# EAGLE design Dartautomat (EAGLE 9.6.2)
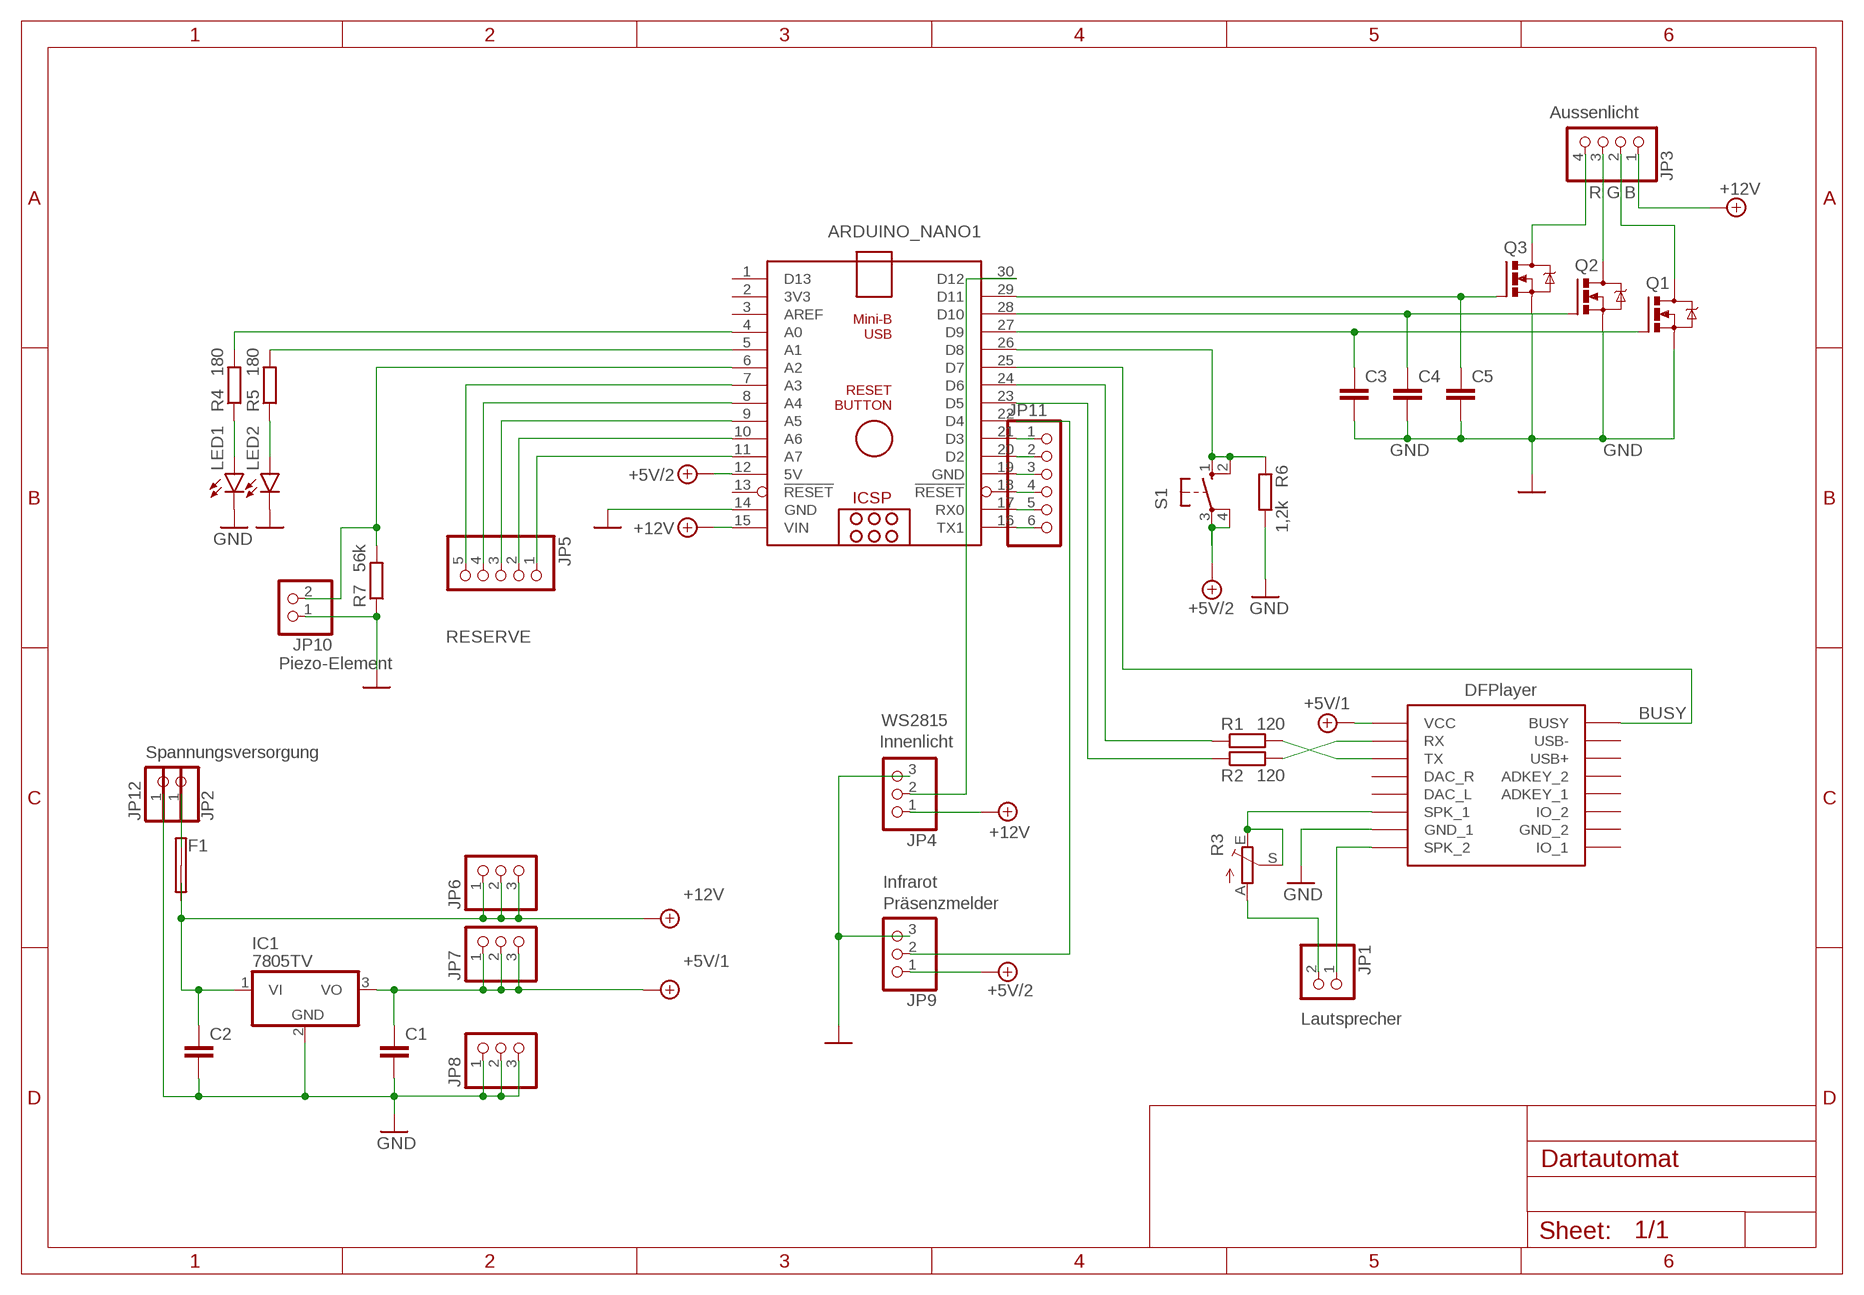
[diagram p0: schematic, sheet 1]

## Parts
ARDUINO_NANO1  ARDUINO_NANO  [ARDUINO_NANO]
C1  C-EU050-045X075  [C050-045X075]
C2  C-EU050-045X075  [C050-045X075]
C3  C-EU050-045X075  [C050-045X075]
C4  C-EU050-045X075  [C050-045X075]
C5  C-EU050-045X075  [C050-045X075]
F1  SHK20L  [SHK20L]
IC1  7805TV  [TO220V]
JP1  PINHD-1X2  [1X02]
JP2  PINHD-1X1  [1X01]
JP3  PINHD-1X4  [1X04]
JP4  PINHD-1X3  [1X03]
JP5  PINHD-1X5  [1X05]
JP6  PINHD-1X3  [1X03]
JP7  PINHD-1X3  [1X03]
JP8  PINHD-1X3  [1X03]
JP9  PINHD-1X3  [1X03]
JP10  PINHD-1X2  [1X02]
JP11  PINHD-1X6  [1X06]
JP12  PINHD-1X1  [1X01]
LED1  LED3MM  [LED3MM]
LED2  LED3MM  [LED3MM]
Q1  IRLZ44ZNEU  [TO220BV]
Q2  IRLZ44ZNEU  [TO220BV]
Q3  IRLZ44ZNEU  [TO220BV]
R1  120  R-EU_0207/10  [0207/10]
R2  120  R-EU_0207/10  [0207/10]
R3  TRIM_EU-CA6H  [CA6H]
R4  180  R-EU_0207/12  [0207/12]
R5  180  R-EU_0207/12  [0207/12]
R6  1,2k  R-EU_0207/12  [0207/12]
R7  56k  R-EU_0207/12  [0207/12]
S1  10-XX  [B3F-10XX]
U$1  DFPLAYER  [DFPLAYER]

## Nets
+5V/1: C1.1 IC1.3(VO) JP7.1 JP7.2 JP7.3 U$1.VCC
+5V/2: ARDUINO_NANO1.12(5V) JP9.1 S1.3(P) S1.4(P1)
+12V: ARDUINO_NANO1.15(VIN) C2.1 F1.1A F1.1B IC1.1(VI) JP3.1 JP4.1 JP6.1 JP6.2 JP6.3
BUSY: ARDUINO_NANO1.25(D7) U$1.BUSY
GND: ARDUINO_NANO1.14(GND) C1.2 C2.2 C3.2 C4.2 C5.2 IC1.2(GND) JP4.3 JP8.1 JP8.2 JP8.3 JP9.3 JP10.1 JP12.1 LED1.K(C) LED2.K(C) Q1.S Q2.S Q3.S R6.2 R7.1 U$1.GND_1
N$1: ARDUINO_NANO1.30(D12) JP4.2
N$2: R2.2 U$1.RX
N$3: ARDUINO_NANO1.29(D11) C5.1 Q3.G
N$4: R1.2 U$1.TX
N$5: JP1.2 R3.A
N$6: JP1.1 U$1.SPK2(SPK_2)
N$7: R3.E R3.S U$1.SPK1(SPK_1)
N$8: JP3.3 Q2.D
N$9: ARDUINO_NANO1.23(D5) R2.1
N$10: ARDUINO_NANO1.21(D3) JP11.1
N$11: JP3.2 Q1.D
N$12: JP3.4 Q3.D
N$13: ARDUINO_NANO1.24(D6) R1.1
N$14: ARDUINO_NANO1.20(D2) JP11.2
N$15: LED1.A R4.1
N$16: LED2.A R5.1
N$17: ARDUINO_NANO1.5(A1) R5.2
N$18: ARDUINO_NANO1.4(A0) R4.2
N$19: ARDUINO_NANO1.11(A7) JP5.1
N$20: ARDUINO_NANO1.10(A6) JP5.2
N$21: ARDUINO_NANO1.9(A5) JP5.3
N$22: ARDUINO_NANO1.8(A4) JP5.4
N$23: ARDUINO_NANO1.7(A3) JP5.5
N$24: ARDUINO_NANO1.6(A2) JP10.2 R7.2
N$25: ARDUINO_NANO1.22(D4) JP9.2
N$26: ARDUINO_NANO1.26(D8) R6.1 S1.1(S) S1.2(S1)
N$27: F1.2A F1.2B JP2.1
N$28: ARDUINO_NANO1.19(GND) JP11.3
N$29: ARDUINO_NANO1.18(!RESET) JP11.4
N$30: ARDUINO_NANO1.17(RX0) JP11.5
N$31: ARDUINO_NANO1.27(D9) C3.1 Q1.G
N$32: ARDUINO_NANO1.16(TX1) JP11.6
N$33: ARDUINO_NANO1.28(D10) C4.1 Q2.G
Unconnected: ARDUINO_NANO1.1(D13) ARDUINO_NANO1.2(3V3) ARDUINO_NANO1.3(AREF) ARDUINO_NANO1.13(!RESET) U$1.ADKEY1(ADKEY_1) U$1.ADKEY2(ADKEY_2) U$1.DAC_L U$1.DAC_R U$1.GND_2 U$1.IO1(IO_1) U$1.IO2(IO_2) U$1.USB+ U$1.USB-

## Notes on the sheet
- Aussenlicht
- R | G | B
- RESERVE
- Piezo-Element
- DFPlayer
- WS2815
- Innenlicht
- Spannungsversorgung
- Infrarot
- Präsenzmelder
- Lautsprecher

## Library data of the parts
ARDUINO_NANO1 = ArduinoNanoV30:ARDUINO_NANO: Arduino Nano V3.0 Overview: The Arduino Nano is a small, complete, and breadboard-friendly board based on the ATmega328 (Arduino Nano 3.x) or ATmega168 (Arduino Nano 2.x). It has more or less the same functionality of the Arduino Duemilanove, but in a different package. It lacks only a DC power jack, and works with a Mini-B USB cable instead of a standard one. The Nano was designed and is being produced by Gravitech. Specifications: Microcontroller Atmel ATmega168 or ATmega328 Operating Voltage (logic level) 5 V Input Voltage (recommended) 7-12 V Input Voltage (limits) 6-20 V Digital I/O Pins 14 (of which 6 provide PWM output) Analog Input Pins 8 DC Current per I/O Pin 40 mA Flash Memory 16 KB (ATmega168) or 32 KB (ATmega328) of which 2 KB used by bootloader SRAM 1 KB (ATmega168) or 2 KB (ATmega328) EEPROM 512 bytes (ATmega168) or 1 KB (ATmega328) Clock Speed 16 MHz Dimensions 0.73" x 1.70" Length 45 mm Width 18 mm Weigth 5 g Power: The Arduino Nano can be powered via the Mini-B USB connection, 6-20V unregulated external power supply (pin 30), or 5V regulated external power supply (pin 27). The power source is automatically selected to the highest voltage source. Memory: The ATmega168 has 16 KB of flash memory for storing code (of which 2 KB is used for the bootloader); the ATmega328 has 32 KB, (also with 2 KB used for the bootloader). The ATmega168 has 1 KB of SRAM and 512 bytes of EEPROM (which can be read and written with the EEPROM library); the ATmega328 has 2 KB of SRAM and 1 KB of EEPROM. Input and Output: Each of the 14 digital pins on the Nano can be used as an input or output, using pinMode(), digitalWrite(), and digitalRead() functions. They operate at 5 volts. Each pin can provide or receive a maximum of 40 mA and has an internal pull-up resistor (disconnected by default) of 20-50 kOhms. In addition, some pins have specialized functions. Visit Arduino - ArduinoBoardNano <https://www.arduino.cc/en/Main/ArduinoBoardNano>
C1-C5 = rcl:C-EU: CAPACITOR, European symbol; SPICEPREFIX: C
F1 = fuse:SHK20L: FUSE HOLDER 5 x 20 mm, SH contact, SHH1 Schukat, E1073 Buerklin; OC_FARNELL: unknown; OC_NEWARK: unknown
IC1 = linear:78*: Positive VOLTAGE REGULATOR Source: http://cache.national.com/ds/LM/LM78L05.pdf http://www.fairchildsemi.com/ds/LM/LM7805.pdf
JP1 JP10 = pinhead:PINHD-1X2: PIN HEADER
JP2 JP12 = pinhead:PINHD-1X1: PIN HEADER
JP3 = pinhead:PINHD-1X4: PIN HEADER
JP4 JP6-JP9 = pinhead:PINHD-1X3: PIN HEADER
JP5 = pinhead:PINHD-1X5: PIN HEADER
JP11 = pinhead:PINHD-1X6: PIN HEADER
LED1 LED2 = led:LED: LED OSRAM: - CHIPLED LG R971, LG N971, LY N971, LG Q971, LY Q971, LO R971, LY R971 LH N974, LH R974 LS Q976, LO Q976, LY Q976 LO Q996 - Hyper CHIPLED LW Q18S LB Q993, LB Q99A, LB R99A - SideLED LS A670, LO A670, LY A670, LG A670, LP A670 LB A673, LV A673, LT A673, LW A673 LH A674 LY A675 LS A676, LA A676, LO A676, LY A676, LW A676 LS A679, LY A679, LG A679 - Hyper Micro SIDELED® LS Y876, LA Y876, LO Y876, LY Y876 LT Y87S - SmartLED LW L88C, LW L88S LB L89C, LB L89S, LG L890 LS L89K, LO L89K, LY L89K LS L896, LA L896, LO L896, LY L896 - TOPLED LS T670, LO T670, LY T670, LG T670, LP T670 LSG T670, LSP T670, LSY T670, LOP T670, LYG T670 LG T671, LOG T671, LSG T671 LB T673, LV T673, LT T673, LW T673 LH T674 LS T676, LA T676, LO T676, LY T676, LB T676, LH T676, LSB T676, LW T676 LB T67C, LV T67C, LT T67C, LS T67K, LO T67K, LY T67K, LW E67C LS E67B, LA E67B, LO E67B, LY E67B, LB E67C, LV E67C, LT E67C LW T67C LS T679, LY T679, LG T679 LS T770, LO T770, LY T770, LG T770, LP T770 LB T773, LV T773, LT T773, LW T773 LH T774 LS E675, LA E675, LY E675, LS T675 LS T776, LA T776, LO T776, LY T776, LB T776 LHGB T686 LT T68C, LB T68C - Hyper Mini TOPLED® LB M676 - Mini TOPLED Santana® LG M470 LS M47K, LO M47K, LY M47K Source: http://www.osram.convergy.de LUXEON: - LUMILED® LXK2-PW12-R00, LXK2-PW12-S00, LXK2-PW14-U00, LXK2-PW14-V00 LXK2-PM12-R00, LXK2-PM12-S00, LXK2-PM14-U00 LXK2-PE12-Q00, LXK2-PE12-R00, LXK2-PE12-S00, LXK2-PE14-T00, LXK2-PE14-U00 LXK2-PB12-K00, LXK2-PB12-L00, LXK2-PB12-M00, LXK2-PB14-N00, LXK2-PB14-P00, LXK2-PB14-Q00 LXK2-PR12-L00, LXK2-PR12-M00, LXK2-PR14-Q00, LXK2-PR14-R00 LXK2-PD12-Q00, LXK2-PD12-R00, LXK2-PD12-S00 LXK2-PH12-R00, LXK2-PH12-S00 LXK2-PL12-P00, LXK2-PL12-Q00, LXK2-PL12-R00 Source: www.luxeon.com KINGBRIGHT: KA-3528ASYC Source: www.kingbright.com
Q1-Q3 = transistor-power-sven:IRLZ44Z: N-Channel HEXFET® Power MOSFET Logic Level AUTOMOTIVE MOSFET Source: http://www.irf.com/product-info/datasheets/data/irlz44zpbf.pdf
R1 R2 R4-R7 = rcl:R-EU_: RESISTOR, European symbol; SPICEPREFIX: R
R3 = pot:TRIM_EU-: POTENTIOMETER
S1 = switch-omron:10-XX: OMRON SWITCH; MPN: B3F-1000; OC_FARNELL: 176432; OC_NEWARK: 36M3542
U$1 = DFPlayer_v1:DFPLAYER

## Board
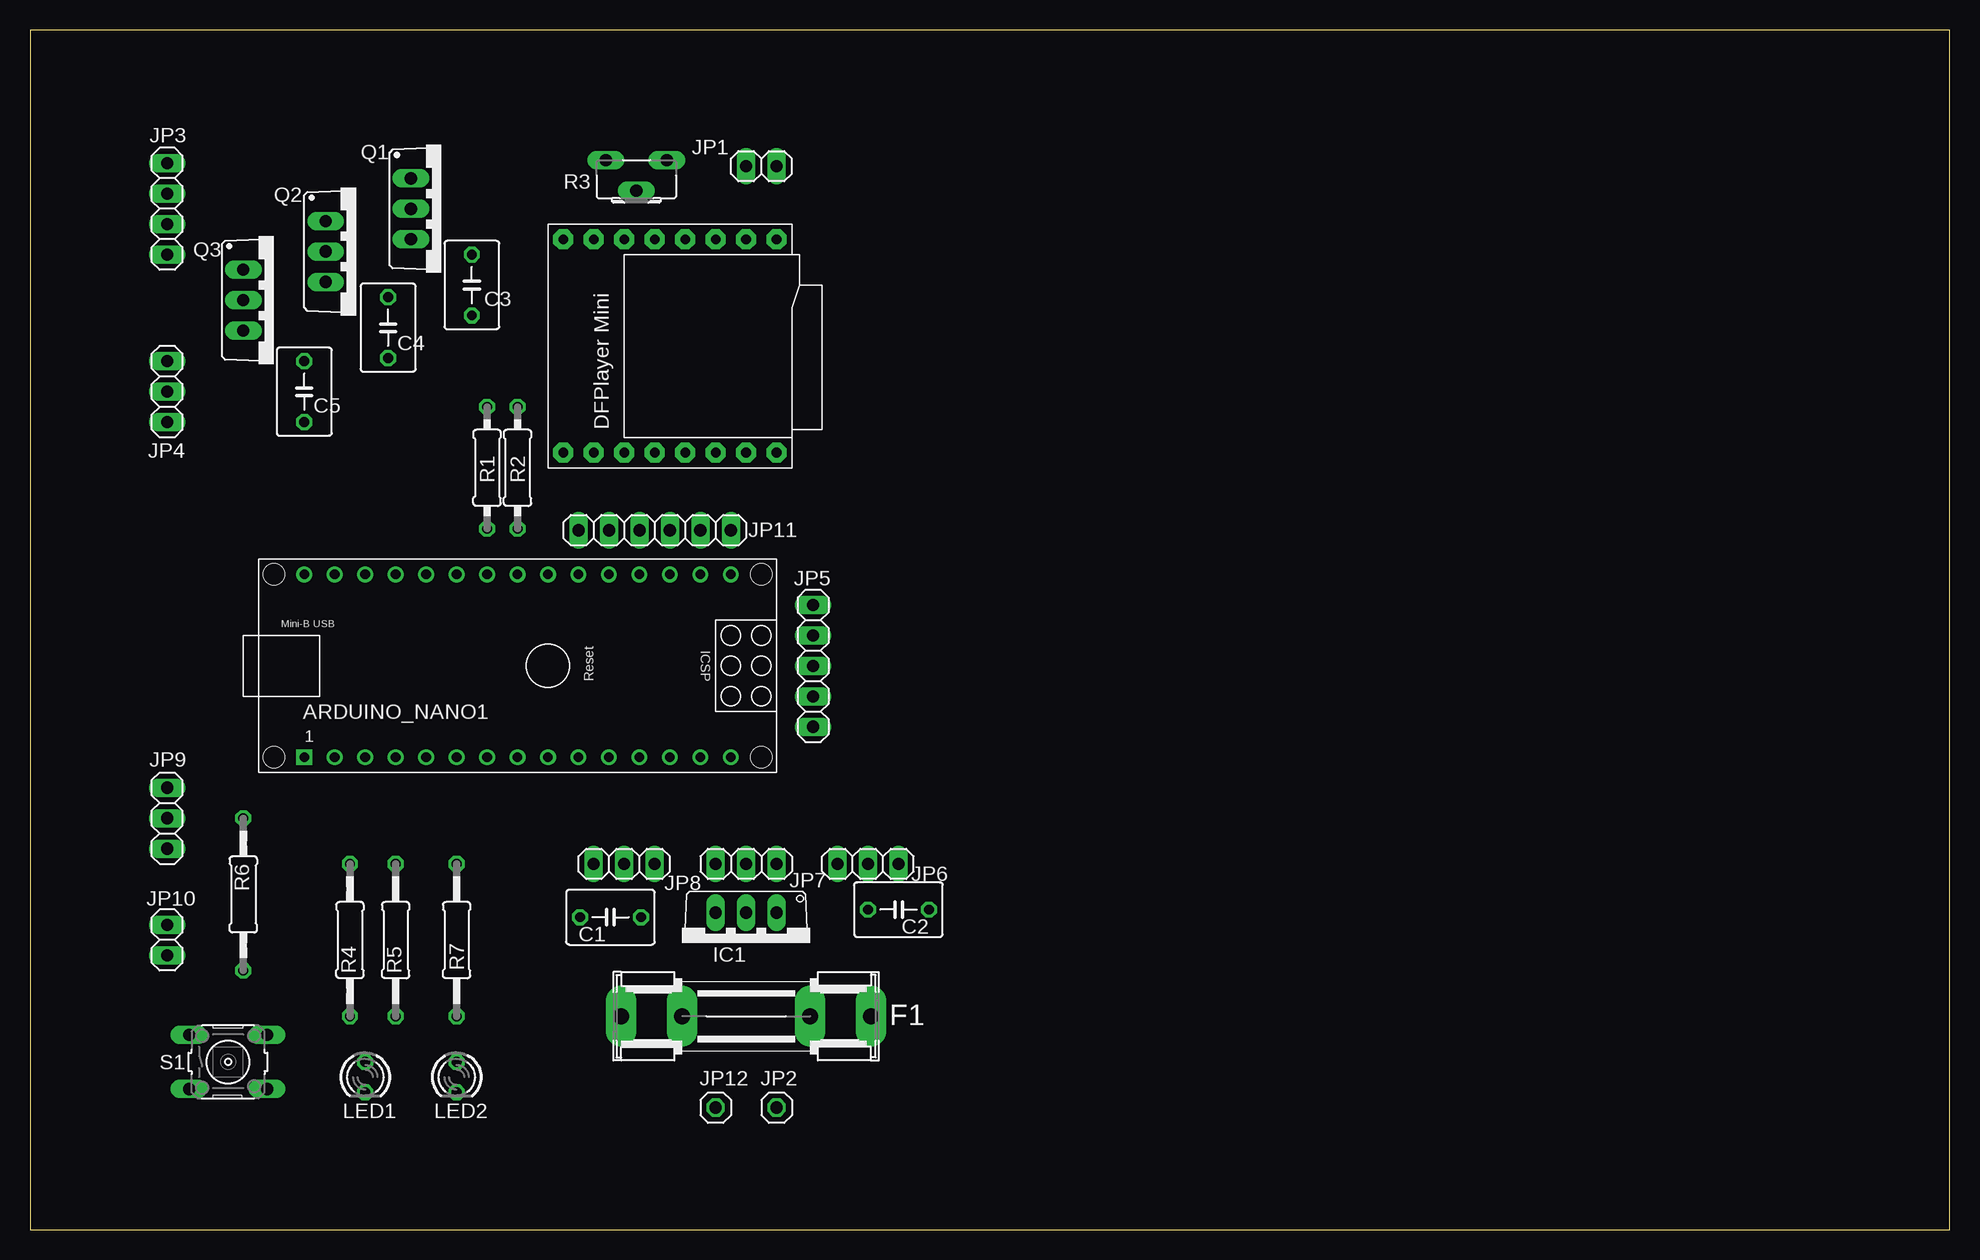
[diagram p1: board, top side]
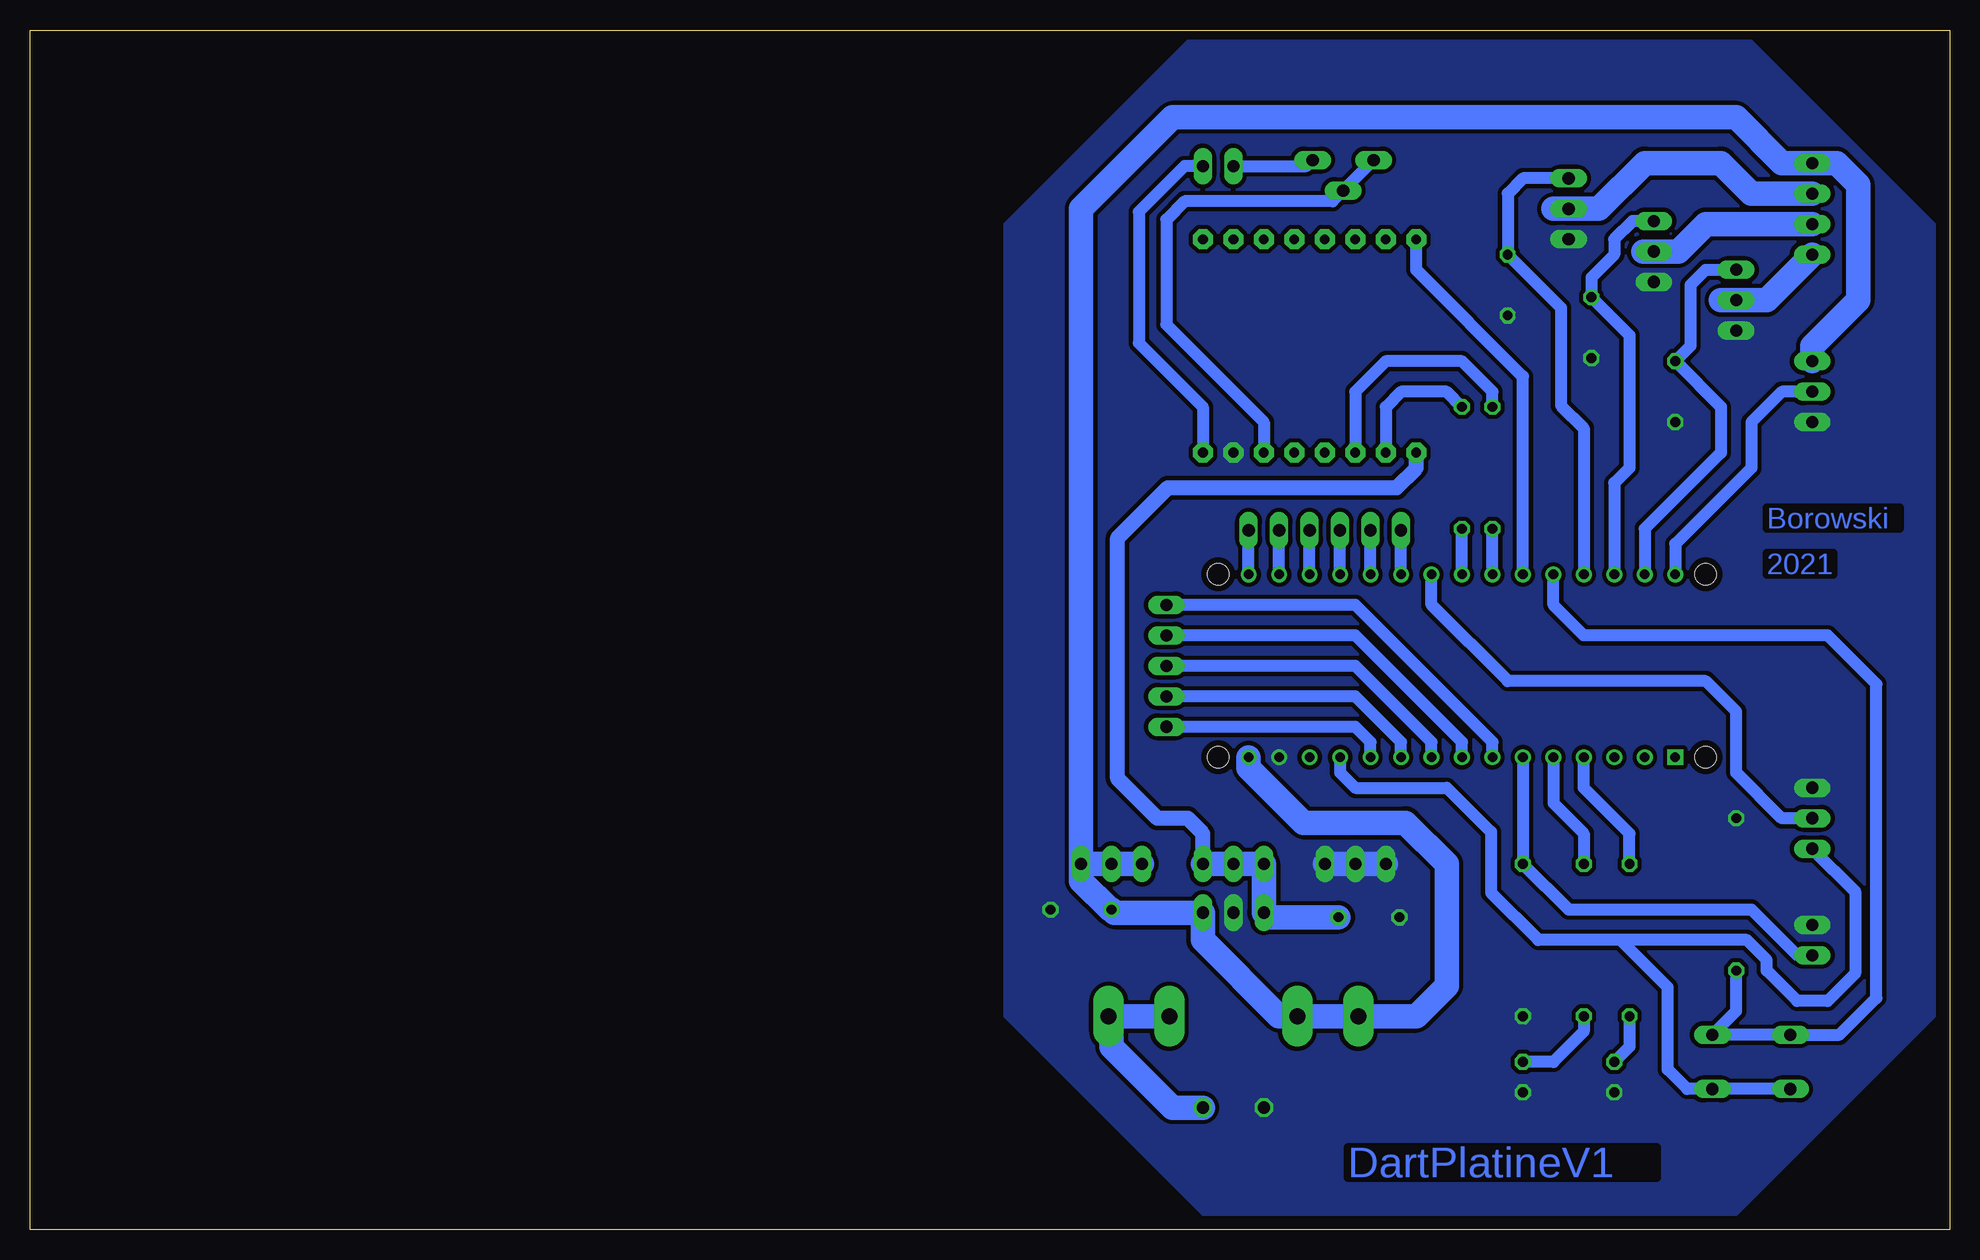
[diagram p2: board, bottom side, seen from below]

Size 160 x 100 mm. Coordinates in mm from the lower left corner, seen from the top.
Outline: 0,0 160,0 160,100 0,100 0,0
Copper layers (1*16): Top 0.035mm / dielectric 1.5mm / Bottom 0.035mm
Design rules "default *": minimum track width 6mil, minimum drill 0.35mm, track to track 14mil, track to pad 14mil, pad to pad 14mil, via to via 14mil, smd to smd 14mil, copper to edge 20mil, drill to drill 6mil, minimum pad ring 10mil, minimum via ring 8mil, stop-mask expansion 4mil, vias tented up to drill 0mil, thermal gap 0mil

### Footprints (pad centres in the part's own frame; a part is rotated, then mirrored left to right if it is on the bottom)
ARDUINO_NANO = drill 0.8 square: 1 -20.32,-7.62 | drill 0.8: 2 -17.78,-7.62; 3 -15.24,-7.62; 4 -12.7,-7.62; 5 -10.16,-7.62; 6 -7.62,-7.62; 7 -5.08,-7.62; 8 -2.54,-7.62; 9 0,-7.62; 10 2.54,-7.62; 11 5.08,-7.62; 12 7.62,-7.62; 13 10.16,-7.62; 14 12.7,-7.62; 15 15.24,-7.62; 16 15.24,7.62; 17 12.7,7.62; 18 10.16,7.62; 19 7.62,7.62; 20 5.08,7.62; 21 2.54,7.62; 22 0,7.62; 23 -2.54,7.62; 24 -5.08,7.62; 25 -7.62,7.62; 26 -10.16,7.62; 27 -12.7,7.62; 28 -15.24,7.62; 29 -17.78,7.62; 30 -20.32,7.62 | hole 1.778: -22.86,-7.62; -22.86,7.62; 17.78,7.62; 17.78,-7.62
C050-045X075 = drill 0.813 octagon: 1 -2.54,0; 2 2.54,0
SHK20L = drill 1.321 pad 2.54 long: 1A -10.414,0; 1B -5.334,0; 2A 10.414,0; 2B 5.334,0
TO220V = drill 1.016 long: 1 -2.54,-2.54; 2 0,-2.54; 3 2.54,-2.54
1X02 = drill 1.016 long: 1 -1.27,0; 2 1.27,0
1X01 = drill 1.016 octagon: 1 0,0
1X04 = drill 1.016 long: 1 -3.81,0; 2 -1.27,0; 3 1.27,0; 4 3.81,0
1X03 = drill 1.016 long: 1 -2.54,0; 2 0,0; 3 2.54,0
1X05 = drill 1.016 long: 1 -5.08,0; 2 -2.54,0; 3 0,0; 4 2.54,0; 5 5.08,0
1X06 = drill 1.016 long: 1 -6.35,0; 2 -3.81,0; 3 -1.27,0; 4 1.27,0; 5 3.81,0; 6 6.35,0
LED3MM = drill 0.813 octagon: A -1.27,0; K 1.27,0
TO220BV = drill 1.016 long: D 0,-2.54; G -2.54,-2.54; S 2.54,-2.54
0207/10 = drill 0.813 octagon: 1 -5.08,0; 2 5.08,0
CA6H = drill 1.016 long: A -2.54,0; E 2.54,0; S 0,2.54
0207/12 = drill 0.813 octagon: 1 -6.35,0; 2 6.35,0
B3F-10XX = drill 1.016 long: 1 -3.251,2.261; 2 3.251,2.261; 3 -3.251,-2.261; 4 3.251,-2.261
DFPLAYER = drill 0.8 pad 1.676 octagon: ADKEY1 8.89,-1.27; ADKEY2 8.89,1.27; BUSY 8.89,8.89; DAC_L -8.89,-1.27; DAC_R -8.89,1.27; GND_1 -8.89,-6.35; GND_2 8.89,-6.35; IO1 8.89,-8.89; IO2 8.89,-3.81; RX -8.89,6.35; SPK1 -8.89,-3.81; SPK2 -8.89,-8.89; TX -8.89,3.81; USB+ 8.89,3.81; USB- 8.89,6.35; VCC -8.89,8.89

### Placement (x,y rotation side)
ARDUINO_NANO1  43.18,46.99 0 top
C1  48.39,26.04 180 top
C2  72.39,26.67 0 top
C3  36.83,78.74 270 top
C4  29.84,75.18 270 top
C5  22.86,69.85 270 top
F1  59.69,17.78 0 top
IC1  59.69,23.88 180 top
JP1  60.96,88.65 180 top
JP2  62.23,10.16 0 top
JP3  11.43,85.09 270 top
JP4  11.43,69.85 270 top
JP5  65.28,46.99 90 top
JP6  69.85,30.48 180 top
JP7  59.69,30.48 0 top
JP8  49.53,30.48 180 top
JP9  11.43,34.29 90 top
JP10  11.43,24.13 270 top
JP11  52.07,58.29 0 top
JP12  57.15,10.16 0 top
LED1  27.94,12.7 270 top
LED2  35.56,12.7 270 top
Q1  34.29,85.09 270 top
Q2  27.18,81.53 270 top
Q3  20.32,77.47 270 top
R1  38.1,63.5 90 top
R2  40.64,63.5 90 top
R3  50.55,89.15 180 top
R4  26.67,24.13 90 top
R5  30.48,24.13 90 top
R6  17.78,27.94 90 top
R7  35.56,24.13 90 top
S1  16.51,13.97 0 top
U$1  53.34,73.66 90 top

### Tracks (layer width: path | path; a pad name or v marks a point on that pad's centre or on a via)
+5V/1
  Bottom 1.27: JP7.3 62.23,33.02 63.5,34.29 66.04,34.29 69.34,37.59 69.34,57.66 65.15,61.85 46.1,61.85 44.45,63.5 U$1.VCC
  Bottom 2.032: C1.1 56.77,26.04 IC1.3 JP7.1 JP7.2 JP7.3
+5V/2
  Bottom 1.016: ARDUINO_NANO1.12 50.8,38.1 49.53,36.83 41.91,36.83 38.23,33.15 38.23,28.07 34.29,24.13 27.43,24.13 | JP9.1 7.87,28.19 7.87,21.34 10.16,19.05 12.7,19.05 15.24,21.59 15.24,22.48 16.89,24.13 27.43,24.13 | 27.43,24.13 23.5,20.19 23.5,13.34 21.87,11.71 S1.4 S1.3
+12V
  Bottom 2.032: JP4.1 11.43,73.66 7.62,77.47 7.62,87.12 9.4,88.9 JP3.1 13.97,88.9 17.78,92.71 64.77,92.71 72.39,85.09 JP6.1 | ARDUINO_NANO1.15 58.42,38.48 53.85,33.91 45.34,33.91 41.91,30.48 41.91,20.32 44.45,17.78 F1.1A F1.1B 55.88,17.78 62.23,24.13 IC1.1 69.6,26.42 C2.1 69.98,26.67 72.39,29.08 JP6.1 | JP6.2 JP6.3 JP6.1
BUSY
  Bottom 1.016: U$1.BUSY 44.45,80.01 35.56,71.12 ARDUINO_NANO1.25
GND
  Bottom 2.032: JP8.1 JP8.3
  pour Bottom: 1.27,83.82 16.51,99.06 63.5,99.06 78.74,83.82 78.74,17.78 62.23,1.27 17.78,1.27 1.27,17.78
N$1
  Bottom 1.016: 12.7,69.85 JP4.2 13.97,69.85 16.51,67.31 16.51,63.5 22.86,57.15 ARDUINO_NANO1.30
N$2
  Bottom 1.016: R2.2 41.91,69.85 45.72,69.85 46.99,68.58 U$1.RX
N$3
  Bottom 1.016: Q3.G 20.32,80.01 21.59,78.74 21.59,73.66 C5.1 19.05,68.58 19.05,64.77 25.4,58.42 ARDUINO_NANO1.29
N$4
  Bottom 1.016: R1.2 38.1,69.85 40.64,72.39 46.99,72.39 49.53,69.85 U$1.TX
N$5
  Bottom 1.016: JP1.2 53.59,88.65 R3.A
N$6
  Bottom 1.016: JP1.1 63.75,88.65 67.56,84.84 67.56,73.91 62.23,68.58 U$1.SPK2
N$7
  Bottom 1.016: R3.E R3.S 51.44,85.72 63.75,85.72 65.28,84.2 65.28,75.44 57.15,67.31 U$1.SPK1
N$8
  Bottom 2.032: JP3.3 20.32,83.82 22.61,81.53 Q2.D 25.53,81.53
N$9
  Bottom 1.016: ARDUINO_NANO1.23 R2.1
N$10
  Bottom 1.016: ARDUINO_NANO1.21 JP11.1
N$11
  Bottom 2.032: JP3.2 16.51,86.36 19.05,88.9 25.4,88.9 29.21,85.09 Q1.D 33.02,85.09
N$12
  Bottom 0.305: Q3.D 19.05,77.47
  Bottom 2.032: JP3.4 15.24,77.47 19.05,77.47
N$13
  Bottom 1.016: ARDUINO_NANO1.24 R1.1
N$14
  Bottom 1.016: ARDUINO_NANO1.20 JP11.2
N$15
  Bottom 1.016: LED1.A 26.67,15.24 R4.1
N$16
  Bottom 1.016: R5.1 30.48,16.51 33.02,13.97 LED2.A
N$17
  Bottom 1.016: R5.2 30.48,33.02 33.02,35.56 ARDUINO_NANO1.5
N$18
  Bottom 1.016: R4.2 26.67,33.02 30.48,36.83 ARDUINO_NANO1.4
N$19
  Bottom 1.016: ARDUINO_NANO1.11 48.26,40.64 49.53,41.91 JP5.1
N$20
  Bottom 1.016: ARDUINO_NANO1.10 45.72,40.64 49.53,44.45 JP5.2
N$21
  Bottom 1.016: ARDUINO_NANO1.9 43.18,40.64 49.53,46.99 JP5.3
N$22
  Bottom 1.016: ARDUINO_NANO1.8 40.64,40.64 49.53,49.53 JP5.4
N$23
  Bottom 1.016: ARDUINO_NANO1.7 38.1,40.64 49.53,52.07 JP5.5
N$24
  Bottom 1.016: ARDUINO_NANO1.6 R7.2 31.75,26.67 16.51,26.67 12.7,22.86 JP10.2
N$25
  Bottom 1.016: ARDUINO_NANO1.22 43.18,52.07 36.83,45.72 20.32,45.72 17.78,43.18 17.78,38.1 13.97,34.29 JP9.2
N$26
  Bottom 1.016: ARDUINO_NANO1.26 33.02,52.07 30.48,49.53 10.16,49.53 6.1,45.47 6.1,19.3 9.17,16.23 S1.1 S1.2 17.78,18.21 R6.1
N$27
  Bottom 1.016: F1.2A 69.85,17.78
  Bottom 2.032: 69.85,17.78 F1.2B | F1.2A 69.85,17.53 69.85,15.24 64.77,10.16 JP2.1
N$28
  Bottom 1.016: ARDUINO_NANO1.19 JP11.3
N$29
  Bottom 1.016: ARDUINO_NANO1.18 JP11.4
N$30
  Bottom 1.016: ARDUINO_NANO1.17 JP11.5
N$31
  Bottom 1.016: Q1.G 35.56,87.63 36.83,86.36 C3.1 32.38,76.83 32.38,68.71 30.48,66.8 ARDUINO_NANO1.27
N$32
  Bottom 1.016: ARDUINO_NANO1.16 JP11.6
N$33
  Bottom 1.016: ARDUINO_NANO1.28 27.94,62.23 26.67,63.5 26.67,74.55 C4.1 29.84,79.38 27.94,81.28 27.94,82.55 26.42,84.07 Q2.G

### Text on the board
Bottom: Borowski | 2021 | DartPlatineV1